# Altium project DC2DC_Buck_Boost_Converter.PrjPcb
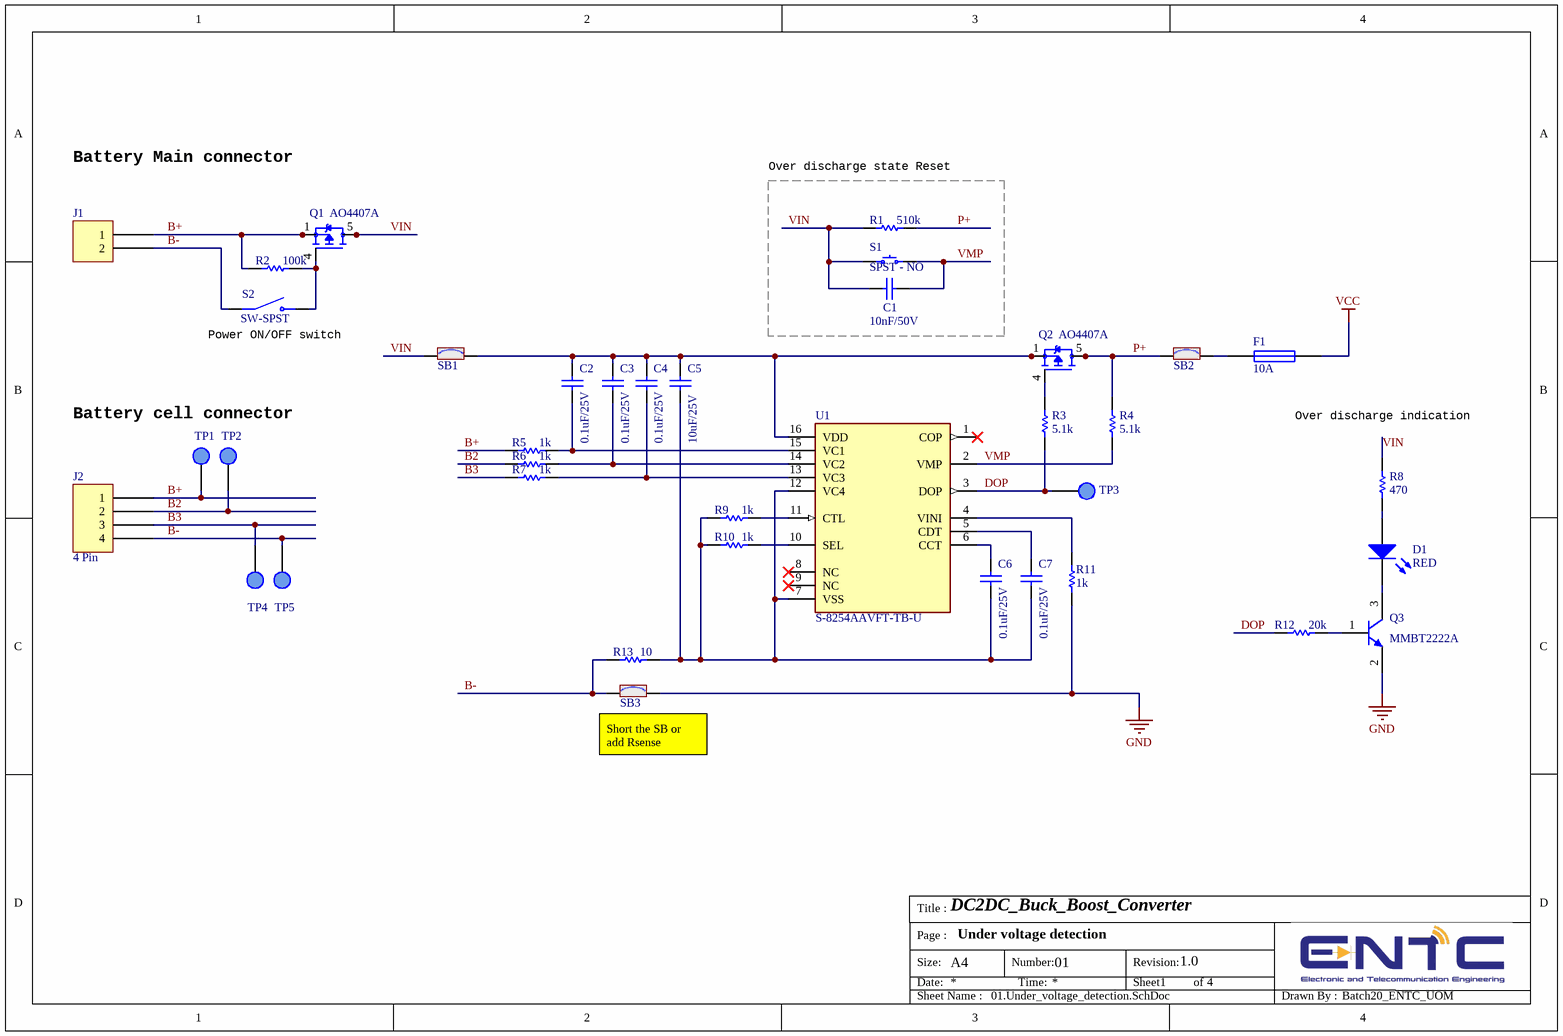
[diagram p0: 01.Under_voltage_detection.SchDoc]
Drawnby: Batch20_ENTC_UOM; Revision: 1.0; Title: DC2DC_Buck_Boost_Converter
4 sheets, 94 parts. Net scope: flat (ports and power ports of the same name join across sheets).
Board file: DC2DC_Buck_Boost_Converter_Layout.PcbDoc
Sheets:
  01.Under_voltage_detection.SchDoc
  02.Power_path.SchDoc
  03.Display.SchDoc
  04.Mechanical.SchDoc

## Sheet 01.Under_voltage_detection.SchDoc: DC2DC_Buck_Boost_Converter
size A4; Organization: Electronic and Telecommunication Department - University of Moratuwa; Address1: Bandaranayake Mawatha; Address2: Moratuwa; Address3: Sri Lanka; Address4: 10400; DocumentNumber: 01; SheetNumber: 1; SheetTotal: 4; Page: Under voltage detection; SPICEModelCache: <root> / <DocumentId>AJVEDORQ</DocumentId> / </root>

### Parts
C1  10nF/50V  [cap0805]
C2  0.1uF/25V  [cap0805]
C3  0.1uF/25V  [cap0805]
C4  0.1uF/25V  [cap0805]
C5  10uF/25V  [cap0805]
C6  0.1uF/25V  [cap0805]
C7  0.1uF/25V  [cap0805]
D1  RED  [LED0805]
F1  10A  [FUSE_4245]
J1  (no value)  [JST XH B2B-XH-A]
J2  4 Pin  [JST XH B4B-XH-A]
Q1  AO4407A  [SOIC127P600X175-8N]
Q2  AO4407A  [SOIC127P600X175-8N]
Q3  MMBT2222A  [SOT23]
R1  510k  [RES0805]
R2  100k  [RES0805]
R3  5.1k  [RES0805]
R4  5.1k  [RES0805]
R5  1k  [RES0805]
R6  1k  [RES0805]
R7  1k  [RES0805]
R8  470  [RES0805]
R9  1k  [RES0805]
R10  1k  [RES0805]
R11  1k  [RES0805]
R12  20k  [RES0805]
R13  10  [RES0805]
S1  SPST - NO  [4312560387x6]
S2  SW-SPST  [SW_TL2230EEF100]
SB1  SB_ON  [SOLDER-BRIDGE_R0805-0R]  (value not drawn)
SB2  SB_ON  [SOLDER-BRIDGE_R0805-0R]  (value not drawn)
SB3  SB_ON  [SOLDER-BRIDGE_R0805-0R]  (value not drawn)
TP1  (no value)  [tp]  (no BOM)
TP2  (no value)  [tp]  (no BOM)
TP3  (no value)  [tp]  (no BOM)
TP4  (no value)  [tp]  (no BOM)
TP5  (no value)  [tp]  (no BOM)
U1  S-8254AAVFT-TB-U  [SOP65P640X110-16N]

### Blocks framed on the sheet
Over discharge state Reset: C1 R1 S1

### Nets
GND: Q3.2(E) R11.1 SB3.2
VCC: F1.2
B2: J2.2 R6.1 TP2.1(TP)
B3: J2.3 R7.1 TP4.1(TP)
B+: J1.1 J2.1 Q1.1(S) Q1.2(S) Q1.3(S) R2.1 R5.1 TP1.1(TP)
B-: J1.2 J2.4 R13.1 S2.2(COM) SB3.1 TP5.1(TP)
DOP: R3.1 R12.2 TP3.1(TP) U1.3(DOP)
P+: Q2.5(D) Q2.6(D) Q2.7(D) Q2.8(D) R1.1 R4.2 SB2.1
VIN: C1.2 Q1.5(D) Q1.6(D) Q1.7(D) Q1.8(D) R1.2 R8.2 S1.1 SB1.1
VMP: C1.1 R4.1 S1.2 U1.2(VMP)
NetC2_1: C2.1 R5.2 U1.15(VC1)
NetC2_2: C2.2 C3.2 C4.2 C5.2 Q2.1(S) Q2.2(S) Q2.3(S) SB1.2 U1.16(VDD)
NetC3_1: C3.1 R6.2 U1.14(VC2)
NetC4_1: C4.1 R7.2 U1.13(VC3)
NetC5_1: C5.1 C6.1 C7.1 R9.1 R10.1 R13.2 U1.7(VSS) U1.12(VC4)
NetC6_2: C6.2 U1.6(CCT)
NetC7_2: C7.2 U1.5(CDT)
NetD1_1: D1.1(A) R8.1
NetD1_2: D1.2(K) Q3.3(C)
NetF1_1: F1.1 SB2.2
NetQ1_4: Q1.4(G) R2.2 S2.3(NO)
NetQ2_4: Q2.4(G) R3.2
NetQ3_1: Q3.1(B) R12.1
NetR9_2: R9.2 U1.11(CTL)
NetR10_2: R10.2 U1.10(SEL)
NetR11_2: R11.2 U1.4(VINI)

Not connected (* = marked no-connect by the designer): U1 1(COP)* 8(NC)* 9(NC)*

### Notes on the sheet
- Battery Main connector
- (near S2) Power ON/OFF switch
- Battery cell connector
- Over discharge indication
- (near SB3) Short the SB or add Rsense
- Title :
- Size:
- Date:
- Page :
- A4
- Number:
- Time:
- Revision:
- Sheet
- of
- Sheet Name :
- Drawn By :

### Library data of the parts
C1 = Cap: Multilayer Ceramic Capacitors MLCC - SMD/SMT 50V 0.01uF X7R 0805 10%; MF: YAGEO; MP: CC0805KRX7R9BB103; MOUSER: 603-CC805KRX7R9BB103
C2-C4 C6 C7 = Cap: Multilayer Ceramic Capacitors MLCC - SMD/SMT KAF21BR71E104KT NEW GLOBAL PN 25V .1uF X A 581-KAF21BR71E104KT; MF: KYOCERA AVX; MP: 08053C104K4Z2A; MOUSER: 581-08053C104K4Z2A
C5 = Cap: Multilayer Ceramic Capacitors MLCC - SMD/SMT KGM21AR51E106KL NEW GLOBAL PN 25V 10uF X A 581-KGM21AR51E106KL; MF: KYOCERA AVX; MP: 08053D106KAT4A; MOUSER: 581-08053D106KAT4A
D1 = LED: Standard LEDs - SMD Super Red, 630nm 9mcd, 2mA; MF: ams OSRAM; MP: LS M67K-H2K1-1-Z; MOUSER: 720-LSM67K-H2K1-1-Z
F1 = Fuse: 10A Glass fuse
J1 = NC6-P108-02: CONN BARRIER STRIP 2CIRC 0.375"
J2 = NC6-P108-04: JST Automotive Connectors XH HEADER (TOP); MP: B4B-XH-AM(LF)(SN); MF: JST Commercial; MOUSER: 306-B4BXHAMLFSNP
Q1 Q2 = AO4407A: MOSFETs P-Channel 2.5W; MP: DMP3020LSS-13; MF: Diodes Incorporated; MOUSER: 621-DMP3020LSS-13
Q3 = NPN: NPN Bipolar Transistor; MF: Diotec Semiconductor; MP: MMBT2222A; MOUSER: 637-MMBT2222A
R1 = Res: Thick Film Resistors - SMD 510K 5%; MP: CR0805-JW-514ELF; MF: Bourns; MOUSER: 652-CR0805JW-514ELF
R2 = Res: Thick Film Resistors - SMD 100K 5%; MP: CR0805-JW-104ELF; MF: Bourns; MOUSER: 652-CR0805JW-104ELF
R3 R4 = Res: Thick Film Resistors - SMD 5.1Kohms 1% 100ppm; MP: RCA08055K10FKEA; MF: Vishay / Draloric; MOUSER: 71-RCA08055K10FKEA
R5 R6 R11 = Res: Thick Film Resistors - SMD 1 kOhms 125 mW 0805 1%; MP: RC0805FR-071KL; MF: YAGEO; MOUSER: 603-RC0805FR-071KL
R7 = Res: Resistor 0805Thick Film Resistors - SMD 1 kOhms 125 mW 0805 1%; MP: RC0805FR-071KL; MF: YAGEO; MOUSER: 603-RC0805FR-071KL
R8 = Res: Thick Film Resistors - SMD 470ohm 5%; MP: CR0805-JW-471ELF; MF: Bourns; MOUSER: 652-CR0805JW-471EL
R9 R10 = Res: Resistor 0805; MP: RC0805FR-071KL; MF: YAGEO; MOUSER: 603-RC0805FR-071KL
R12 = Res: Thick Film Resistors - SMD 20K 1%; MP: CR0805-FX-2002ELF; MF: Bourns; MOUSER: 652-CR0805FX-2002ELF
R13 = Res: Thin Film Resistors - SMD 10 ohm 1% 50 ppm Thin Film; MP: RT0805FRE1310RL; MF: YAGEO; MOUSER: 603-RT0805FRE1310RL
S1 = SPST-NO 4 PIN: Switch Push button
SB1-SB3 = SB_ON: Solder Bridge ON; MP: CR0805AJ/-000EAS; MF: Bourns; MOUSER: 652-CR0805AJ/-000EAS
TP1-TP5 = TP: Test Point
U1 = S-8254AAEFT-TB-G: Battery Management LITHIUM-ION BATTERY PROTECTION 3/4 CELL; MF: ABLIC; MP: S-8254AAVFT-TB-U; MOUSER: 628-S-8254AAVFT-TB-U

## Sheet 02.Power_path.SchDoc: DC2DC_Buck_Boost_Converter
size A4; SPICEModelCacheOOZADGMI: <root> / <DocumentId>OOZADGMI</DocumentId> / </root>; Organization: Electronic and Telecommunication Department - University of Moratuwa; Address1: Bandaranayake Mawatha; Address2: Moratuwa; Address3: Sri Lanka; Address4: 10400; DocumentNumber: 02; SheetNumber: 2; SheetTotal: 4; Page: Power Path
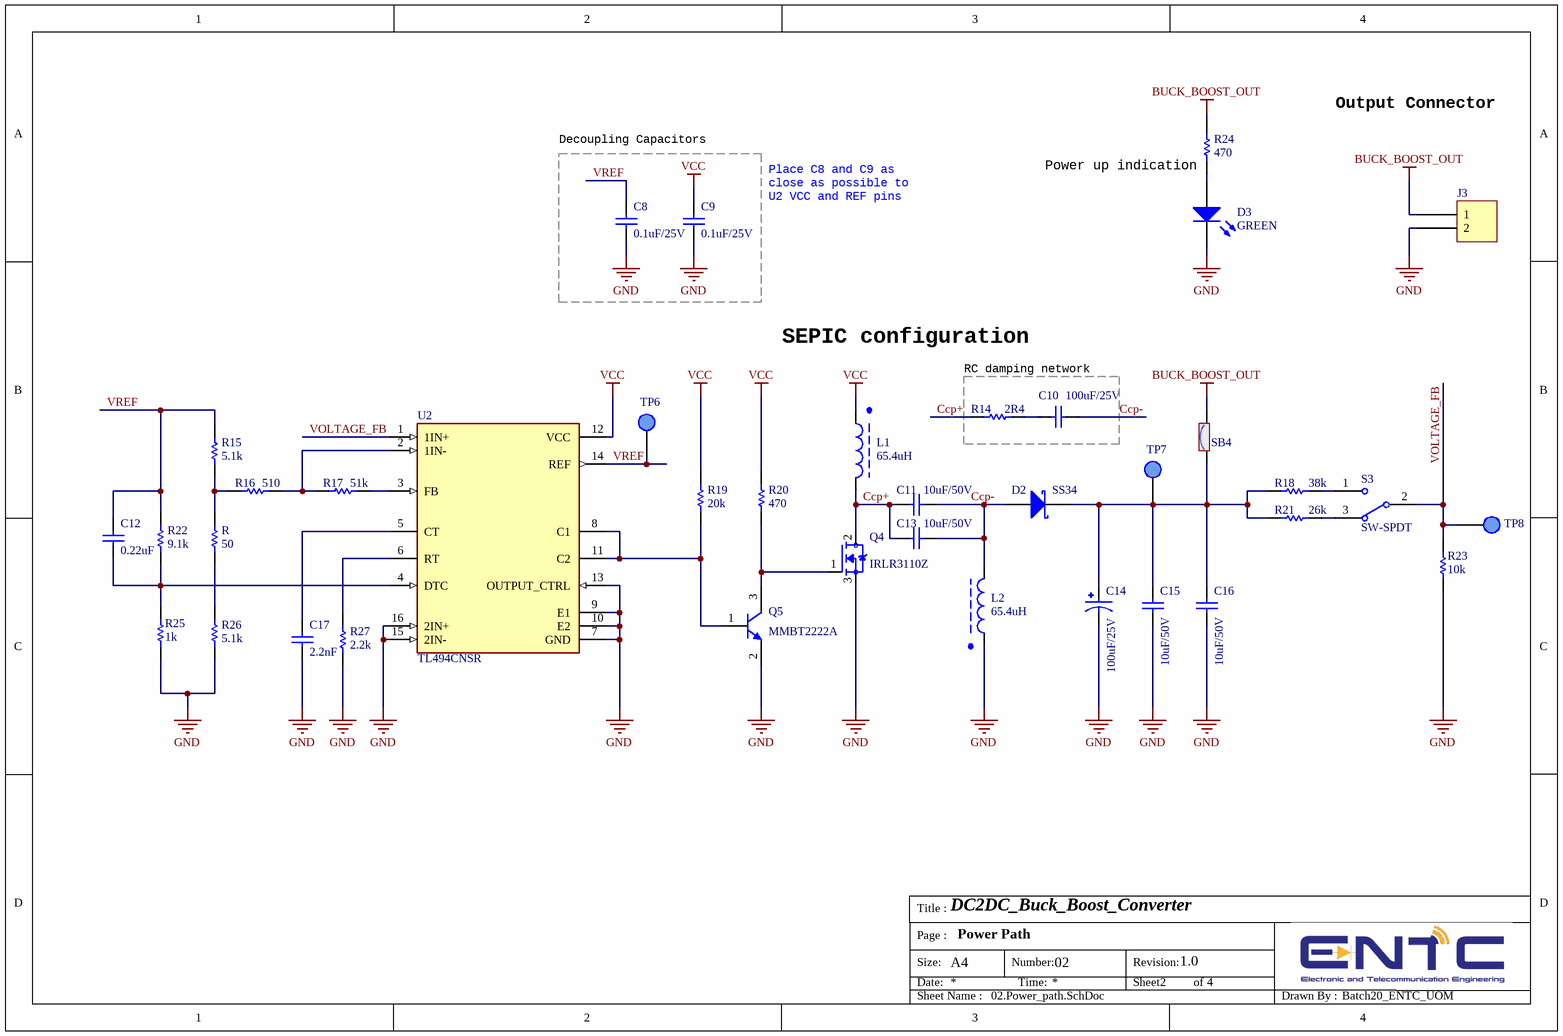
[diagram p1: 02.Power_path.SchDoc]

### Parts
C8  0.1uF/25V  [cap0805]
C9  0.1uF/25V  [cap0805]
C10  100uF/25V  [cap0805]
C11  10uF/50V  [cap0805]
C12  0.22uF  [cap0805]
C13  10uF/50V  [cap0805]
C14  100uF/25V  [CAP_EEEFC0J680P]
C15  10uF/50V  [cap0805]
C16  10uF/50V  [cap0805]
C17  2.2nF  [cap0805]
D2  SS34  [DIO_SS34]
D3  GREEN  [LED0805]
J3  (no value)  [JST XH B2B-XH-A]
L1  65.4uH  [toroid-16x8]
L2  65.4uH  [toroid-16x8]
Q4  IRLR3110Z  [TO252]
Q5  MMBT2222A  [SOT23]
R  50  [RES0402]
R14  2R4  [RES0805]
R15  5.1k  [RES0805]
R16  510  [RES0805]
R17  51k  [RES0805]
R18  38k  [RES0805]
R19  20k  [RES0805]
R20  470  [res1206]
R21  26k  [RES0805]
R22  9.1k  [RES0805]
R23  10k  [RES0805]
R24  470  [RES0805]
R25  1k  [RES0805]
R26  5.1k  [RES0805]
R27  2.2k  [RES0805]
S3  SW-SPDT  [SS12D00G3]
SB4  SB_ON  [SOLDER-BRIDGE_R0805-0R]  (value not drawn)
TP6  VREF  [tp]  (value not drawn)  (no BOM)
TP7  (no value)  [tp]  (no BOM)
TP8  (no value)  [tp]  (no BOM)
U2  TL494CNSR  [SOIC127P780X200-16N]

### Blocks framed on the sheet
Decoupling Capacitors: C8 C9
RC damping network: C10 R14

### Nets
BUCK_BOOST_OUT: J3.1 R24.2 SB4.2
GND: C8.1 C9.1 C14.2 C15.2 C16.2 C17.2 D3.2(K) J3.2 L2.1 Q4.3(S) Q5.2(E) R23.1 R25.1 R26.1 R27.1 U2.7(GND) U2.9(E1) U2.10(E2) U2.13(OUTPUT_CTRL) U2.15(2IN-) U2.16(2IN+)
VCC: C9.2 L1.1 R19.1 R20.2 U2.12(VCC)
Ccp+: C11.2 C13.2 L1.2 Q4.2(D) R14.2
Ccp-: C10.1 C11.1 C13.1 D2.1(A) L2.2
VOLTAGE_FB: R23.2 S3.2 TP8.1(TP) U2.1(1IN+)
VREF: C8.2 C12.1 R15.2 R22.2 TP6.1(TP) U2.14(REF)
NetC10_2: C10.2 R14.1
NetC12_2: C12.2 R22.1 R25.2 U2.4(DTC)
NetC14_1: C14.1 C15.1 C16.1 D2.2(K) R18.2 R21.2 SB4.1 TP7.1(TP)
NetC17_1: C17.1 U2.5(CT)
NetD3_1: D3.1(A) R24.1
NetQ4_1: Q4.1(G) Q5.3(C) R20.1
NetQ5_1: Q5.1(B) R19.2 U2.8(C1) U2.11(C2)
NetR16_1: R16.1 R17.2 U2.2(1IN-)
NetR17_1: R17.1 U2.3(FB)
NetR18_1: R18.1 S3.1
NetR21_1: R21.1 S3.3
NetR27_2: R27.2 U2.6(RT)
NetR_1: R.1 R26.2
NetR_2: R.2 R15.1 R16.2

### Notes on the sheet
- Output Connector
- Power up indication
- Place C8 and C9 as close as possible to U2 VCC and REF pins
- SEPIC configuration
- Title :
- Size:
- Date:
- Page :
- A4
- Number:
- Time:
- Revision:
- Sheet
- of
- Sheet Name :
- Drawn By :

### Library data of the parts
C8 C9 = Cap: as C2 on sheet 01.Under_voltage_detection; MOUSER: 581-08053C104K4Z2A
C10 = Cap: Capacitor; MP: *
C11 C13 C15 C16 = Cap: Multilayer Ceramic Capacitors MLCC - SMD/SMT 10 uF 50 VDC 10% 0805 X5R; MF: Murata Electronics; MP: GRM21BR61H106KE43L; MOUSER: 81-GRM21BR61H106KE3L
C12 = Cap: Multilayer Ceramic Capacitors MLCC - SMD/SMT KGM21AR71H224KU NEW GLOBAL PN 50V 0.22uF A 581-KGM21AR71H224KU; MF: KYOCERA AVX; MP: 08055C224KAT2A; MOUSER: 581-08055C224KAT2A
C14 = Cap Pol: Aluminum Electrolytic Capacitors - SMD WCAP-ASLU 100uF 25V 20% SMD/SMT; MP: 865090449009; MF: Wurth Elektronik; MOUSER: 710-865090449009
C17 = Cap: Multilayer Ceramic Capacitors MLCC - SMD/SMT KAM21BR71H222JT NW G LOB PN 50V 2200pF X7 A 581-KAM21BR71H222JT; MF: KYOCERA AVX; MP: 08055C222J4T2A; MOUSER: 581-08055C222J4T2A
D2 = D Schottky: Schottky Diodes & Rectifiers 40V 3A; MP: B340-13-F; MF: Diodes Incorporated; MOUSER: 621-B340-F
D3 = LED: Standard LEDs - SMD Ultra Green, 574nm 2.2V, 45mcd; MP: SML-LX0805SUGC-TR; MF: Lumex; MOUSER: 696-SML-0805SUGCTR
J3 = NC6-P108-02: Barrier Terminal Blocks NC6-P108-02; MF: TE Connectivity; MP: NC6-P108-02; MOUSER: 571-314376640
L1 L2 = Inductor-ferrite core: Inductor
Q4 = IRLR3110Z: MOSFETs MOSFT 100V 63A 14mOhm 34nC Log Lvl; MP: IRLR3110ZTRLPBF; MF: Infineon Technologies; MOUSER: 942-IRLR3110ZTRLPBF
Q5 = NPN: Bipolar Transistors - BJT BJT, SOT-23, 40V, 600mA, NPN; MF: Diotec Semiconductor; MP: MMBT2222A; MOUSER: 637-MMBT2222A
R = Res: Resistor; Manufacturer: *; Manufacturer part number: *; JLCPCB part number: *
R14 = Res: Thick Film Resistors - SMD 1/4W 0.05 2.4R; MP: CRCW08052R40FKEA; MF: Vishay / Dale; MOUSER: 71-CRCW08052R40FKEA
R15 R26 = Res: as R3 on sheet 01.Under_voltage_detection; MOUSER: 71-RCA08055K10FKEA
R16 = Res: Thick Film Resistors - SMD 510ohm 5%; MP: CR0805-JW-511ELF; MF: Bourns; MOUSER: 652-CR0805JW-511ELF
R17 = Res: Thick Film Resistors - SMD 51K 1%; MP: CR0805-FX-5102ELF; MF: Bourns; MOUSER: 652-CR0805FX-5102ELF
R18 = Res: Thick Film Resistors - SMD CRCW0805 38K 1% 100 RT1; MP: CRCW080538K0FKTA; MF: Vishay / Dale; MOUSER: 71-CRCW080538K0FKTA
R19 = Res: as R12 on sheet 01.Under_voltage_detection; MOUSER: 652-CR0805FX-2002ELF
R20 = Res: Thick Film Resistors - SMD 470ohm 5%; MP: CR1206-JW-471ELF; MF: Bourns; MOUSER: 652-CR1206JW-471ELF
R21 = Res: Thick Film Resistors - SMD 26.1K 1%; MP: CR0805-FX-2612ELF; MF: Bourns; MOUSER: 652-CR0805FX-2612ELF
R22 = Res: Thick Film Resistors - SMD 9.1K 1%; MP: CR0805-FX-9101ELF; MF: Bourns; MOUSER: 652-CR0805FX-9101ELF
R23 = Res: Thin Film Resistors - SMD ResThinFilm 0805 10kR 0.5% 125mW TC25; MP: CRT0805ADY-1002ELF; MF: Bourns; MOUSER: 652-CRT0805ADY-1002E
R24 = Res: as R8 on sheet 01.Under_voltage_detection; MOUSER: 652-CR0805JW-471EL
R25 = Res: as R5 on sheet 01.Under_voltage_detection; MOUSER: 603-RC0805FR-071KL
R27 = Res: Thin Film Resistors - SMD 2.2K ohm 1% 50 ppm Thin Film; MP: RT0805FRE132K2L; MF: YAGEO; MOUSER: 603-RT0805FRE132K2L
S3 = SW-SPDT: SPDT switch
SB4 = SB_ON: as SB1 on sheet 01.Under_voltage_detection; MOUSER: 652-CR0805AJ/-000EAS
TP6-TP8 = TP: Test Point
U2 = TL494CNSR: Switching Controllers PWM Controller; MF: Texas Instruments; MP: TL494CNSR; MOUSER: 595-TL494CNSR

## Sheet 03.Display.SchDoc: DC2DC_Buck_Boost_Converter
size A4; Organization: Electronic and Telecommunication Department - University of Moratuwa; Address1: Bandaranayake Mawatha; Address2: Moratuwa; Address3: Sri Lanka; Address4: 10400; DocumentNumber: 03; SheetNumber: 3; SheetTotal: 4; Page: Output voltage display
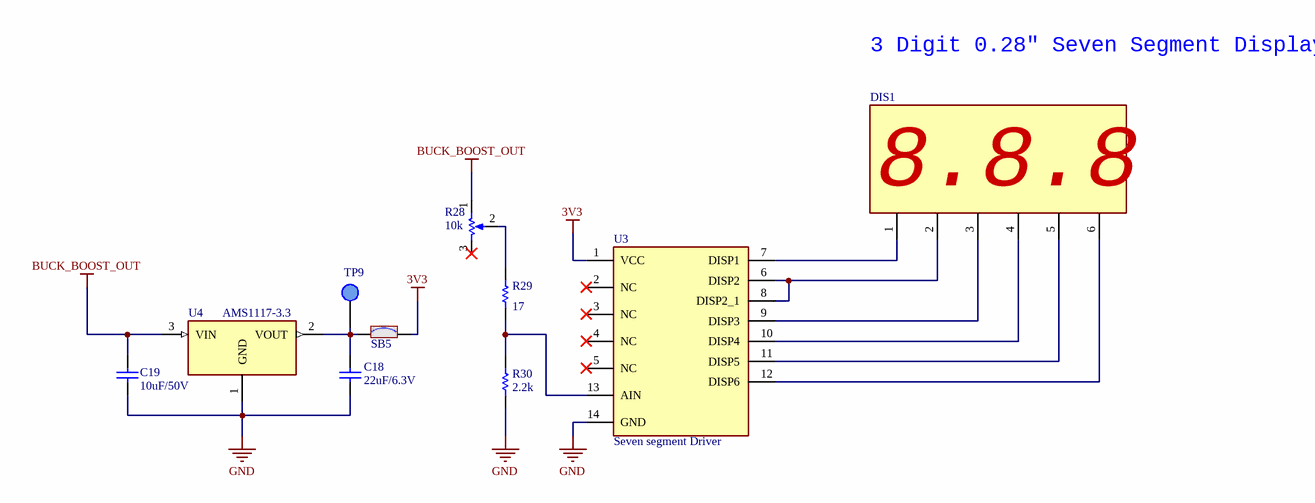
[diagram p2: 03.Display.SchDoc]

### Parts
C18  22uF/6.3V  [cap0805]
C19  10uF/50V  [cap0805]
DIS1  6pin 3 digit seven segment display module  [7Segment-0.28inch]  (value not drawn)
R28  10k  [TRIM_TC33X-2-201G]
R29  17  [RES0805]
R30  2.2k  [RES0805]
SB5  SB_ON  [SOLDER-BRIDGE_R0805-0R]  (value not drawn)
TP9  (no value)  [tp]  (no BOM)
U3  Seven segment Driver  [SOIC127P600X175-14N]
U4  AMS1117-3.3  [SOT229P700X180-4N]

### Nets
3V3: SB5.2 U3.1(VCC)
BUCK_BOOST_OUT: C19.1 R28.1(TOP) U4.3(VIN)
GND: C18.2 C19.2 R30.1 U3.14(GND) U4.1(GND)
NetC18_1: C18.1 SB5.1 TP9.1(TP) U4.2(VOUT)
NetDIS1_1: DIS1.1 U3.7(DISP1)
NetDIS1_2: DIS1.2 U3.6(DISP2) U3.8(DISP2_1)
NetDIS1_3: DIS1.3 U3.9(DISP3)
NetDIS1_4: DIS1.4 U3.10(DISP4)
NetDIS1_5: DIS1.5 U3.11(DISP5)
NetDIS1_6: DIS1.6 U3.12(DISP6)
NetR28_2: R28.2(TAP) R29.2
NetR29_1: R29.1 R30.2 U3.13(AIN)

Not connected (* = marked no-connect by the designer): R28 3(BOT)*; U3 2(NC)* 3(NC)* 4(NC)* 5(NC)*

### Notes on the sheet
- 3 Digit 0.28" Seven Segment Display
- Title :
- Size:
- Date:
- Page :
- A4
- Number:
- Time:
- Revision:
- Sheet
- of
- Sheet Name :
- Drawn By :
- (in symbol SevenSegment6Pin) 8.8.8

### Library data of the parts
C18 = Cap: Multilayer Ceramic Capacitors MLCC - SMD/SMT 6.3V 22uF X5R 0805 20 %; MF: TAIYO YUDEN; MP: JMK212BJ226MG-T; MOUSER: 963-JMK212BJ226MG-T
C19 = Cap: as C11 on sheet 02.Power_path; MOUSER: 81-GRM21BR61H106KE3L
DIS1 = SevenSegment6Pin
R28 = RPot: Potentiometer
R29 = Res: Thick Film Resistors - SMD 17.4OHM 1/10WATT 1%; MP: CR0603-FX-17R4ELF; MF: Bourns; MOUSER: 652-CR0603-FX17R4ELF
R30 = Res: as R27 on sheet 02.Power_path; MOUSER: 603-RT0805FRE132K2L
SB5 = SB_ON: as SB1 on sheet 01.Under_voltage_detection; MOUSER: 652-CR0805AJ/-000EAS
TP9 = TP: Test Point
U3 = Seven segment Driver: ADC/MUX/Binary2BCD/BCDto7Segment; MF: ABLIC; MP: S-8254AAEFT-TB-G; MOUSER: 628-8254AAE-G
U4 = AMS1117-3.3: LDO Voltage Regulators 800MA LDO LINEAR REG; MF: Texas Instruments; MP: LM1117MPX-3.3/NOPB; MOUSER: 926-LM1117MPX3.3NOPB

## Sheet 04.Mechanical.SchDoc: DC2DC_Buck_Boost_Converter
size A4; Organization: Electronic and Telecommunication Department - University of Moratuwa; Address1: Bandaranayake Mawatha; Address2: Moratuwa; Address3: Sri Lanka; Address4: 10400; DocumentNumber: 04; SheetNumber: 4; SheetTotal: 4; Page: Mechanical Information
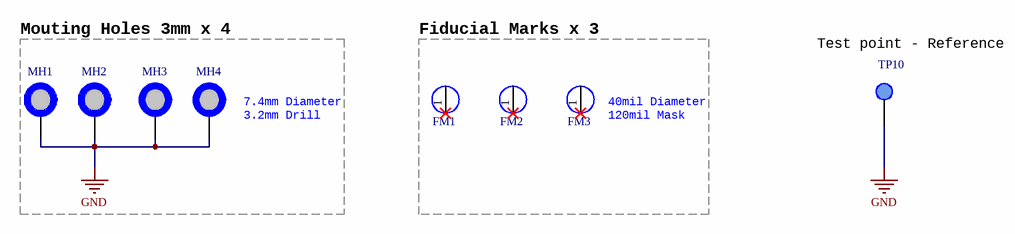
[diagram p3: 04.Mechanical.SchDoc]

### Parts
FM1  FM  [FM]  (value not drawn)  (no BOM)
FM2  FM  [FM]  (value not drawn)  (no BOM)
FM3  FM  [FM]  (value not drawn)  (no BOM)
MH1  MH_7.4MMC_3.2MMD  [MECHANICAL_M3]  (value not drawn)  (no BOM)
MH2  MH_7.4MMC_3.2MMD  [MECHANICAL_M3]  (value not drawn)  (no BOM)
MH3  MH_7.4MMC_3.2MMD  [MECHANICAL_M3]  (value not drawn)  (no BOM)
MH4  MH_7.4MMC_3.2MMD  [MECHANICAL_M3]  (value not drawn)  (no BOM)
TP10  (no value)  [tp]  (no BOM)

### Blocks framed on the sheet
Mouting Holes 3mm x 4: MH1-MH4
Fiducial Marks x 3: FM1-FM3

### Nets
GND: MH1.1 MH2.1 MH3.1 MH4.1 TP10.1(TP)

Not connected (* = marked no-connect by the designer): FM1 1(FM)*; FM2 1(FM)*; FM3 1(FM)*

### Notes on the sheet
- (near TP10) Test point - Reference
- (near MH4) 7.4mm Diameter
  3.2mm Drill
- (near FM3) 40mil Diameter 120mil Mask
- Title :
- Size:
- Date:
- Page :
- A4
- Number:
- Time:
- Revision:
- Sheet
- of
- Sheet Name :
- Drawn By :

### Library data of the parts
FM1-FM3 = FM: Fiducial mark
MH1-MH4 = Mounting_Hole2: Mounting Hole 7.4mm Diameter, 3.2mm Drill
TP10 = TP: Test Point

## Nets that join several sheets
BUCK_BOOST_OUT: 02.Power_path (J3.1 R24.2 SB4.2), 03.Display (C19.1 R28.1 U4.3)
GND: 01.Under_voltage_detection (Q3.2 R11.1 SB3.2), 02.Power_path (21 pins), 03.Display (5 pins), 04.Mechanical (5 pins)
VCC: 01.Under_voltage_detection (F1.2), 02.Power_path (5 pins)

## Assembly variants
DC2DC_Buck_Boost_Converter_DNP: not fitted C? R? SB? SB? SB? SB?